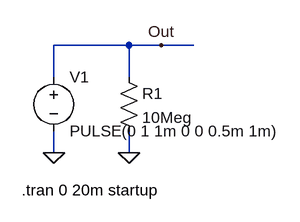
[diagram p0: schematic Draft3.asc]
Draft3.asc, the LTspice schematic file:
Version 4.1
SHEET 1 880 680
WIRE 304 96 192 96
WIRE 352 96 304 96
WIRE 400 96 352 96
WIRE 192 144 192 96
WIRE 304 144 304 96
WIRE 192 256 192 224
WIRE 304 256 304 224
FLAG 192 256 0
FLAG 304 256 0
FLAG 352 96 Out
SYMBOL voltage 192 128 R0
WINDOW 123 0 0 Left 0
WINDOW 39 0 0 Left 0
SYMATTR InstName V1
SYMATTR Value PULSE(0 1 1m 0 0 0.5m 1m)
SYMBOL res 288 128 R0
SYMATTR InstName R1
SYMATTR Value 10Meg
TEXT 144 312 Left 2 !.tran 0 20m startup

The netlist it stands for:
* Draft3.asc
V1 Out 0 PULSE(0 1 1m 0 0 0.5m 1m)
R1 Out 0 10Meg
.tran 0 20m startup
.backanno
.end